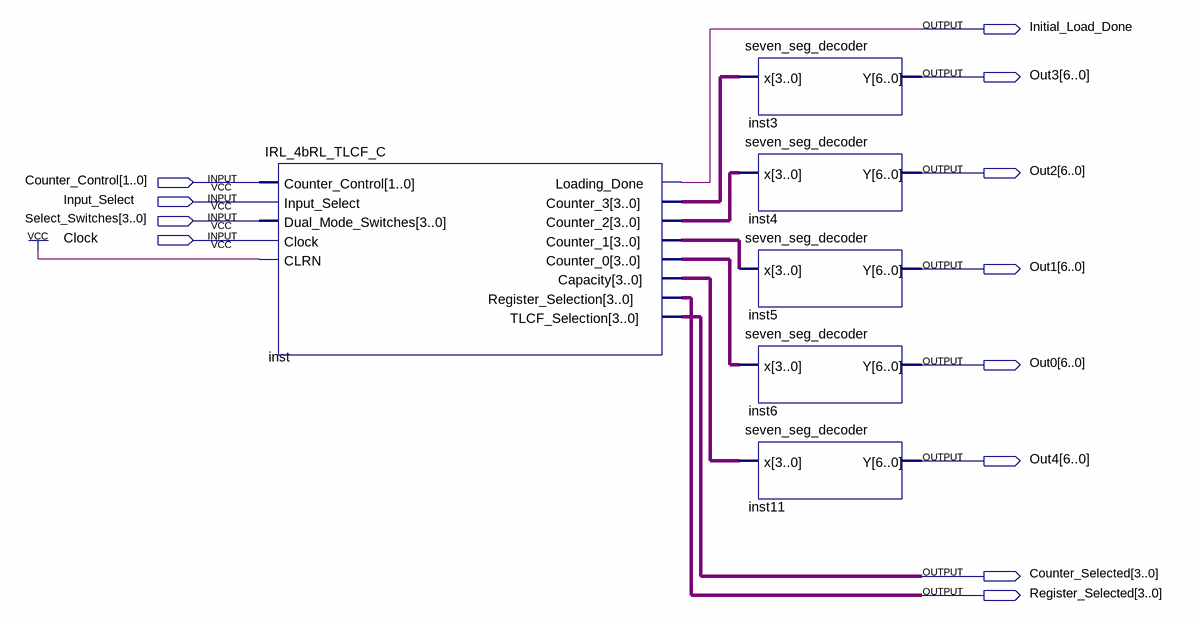
[diagram p0: schematic sheet]
// Quartus schematic IRL_4bRL_TLCF_C_Test.bdf as structural Verilog: 6 symbols, 12 pins
module IRL_4bRL_TLCF_C_Test (
  input  [1:0] Counter_Control,
  input  Input_Select,
  input  [3:0] Select_Switches,
  input  Clock,
  output Initial_Load_Done,
  output [6:0] Out3,
  output [6:0] Out2,
  output [6:0] Out1,
  output [6:0] Out0,
  output [6:0] Out4,
  output [3:0] Counter_Selected,
  output [3:0] Register_Selected
);

  wire [3:0] inst_capacity, inst_counter_0, inst_counter_1, inst_counter_2, inst_counter_3;

  IRL_4bRL_TLCF_C inst (
    .Counter_Control(Counter_Control), .Input_Select(Input_Select), .Dual_Mode_Switches(Select_Switches),
    .Clock(Clock), .CLRN(1'b1), .Loading_Done(Initial_Load_Done), .Counter_3(inst_counter_3),
    .Counter_2(inst_counter_2), .Counter_1(inst_counter_1), .Counter_0(inst_counter_0),
    .Capacity(inst_capacity), .Register_Selection(Register_Selected), .TLCF_Selection(Counter_Selected));
  seven_seg_decoder inst3 (.x(inst_counter_3), .Y(Out3));
  seven_seg_decoder inst4 (.x(inst_counter_2), .Y(Out2));
  seven_seg_decoder inst5 (.x(inst_counter_1), .Y(Out1));
  seven_seg_decoder inst6 (.x(inst_counter_0), .Y(Out0));
  seven_seg_decoder inst11 (.x(inst_capacity), .Y(Out4));
endmodule
